# EasyEDA Pro project PicoUSBMotherboardV1.1.eprj, board PCB1
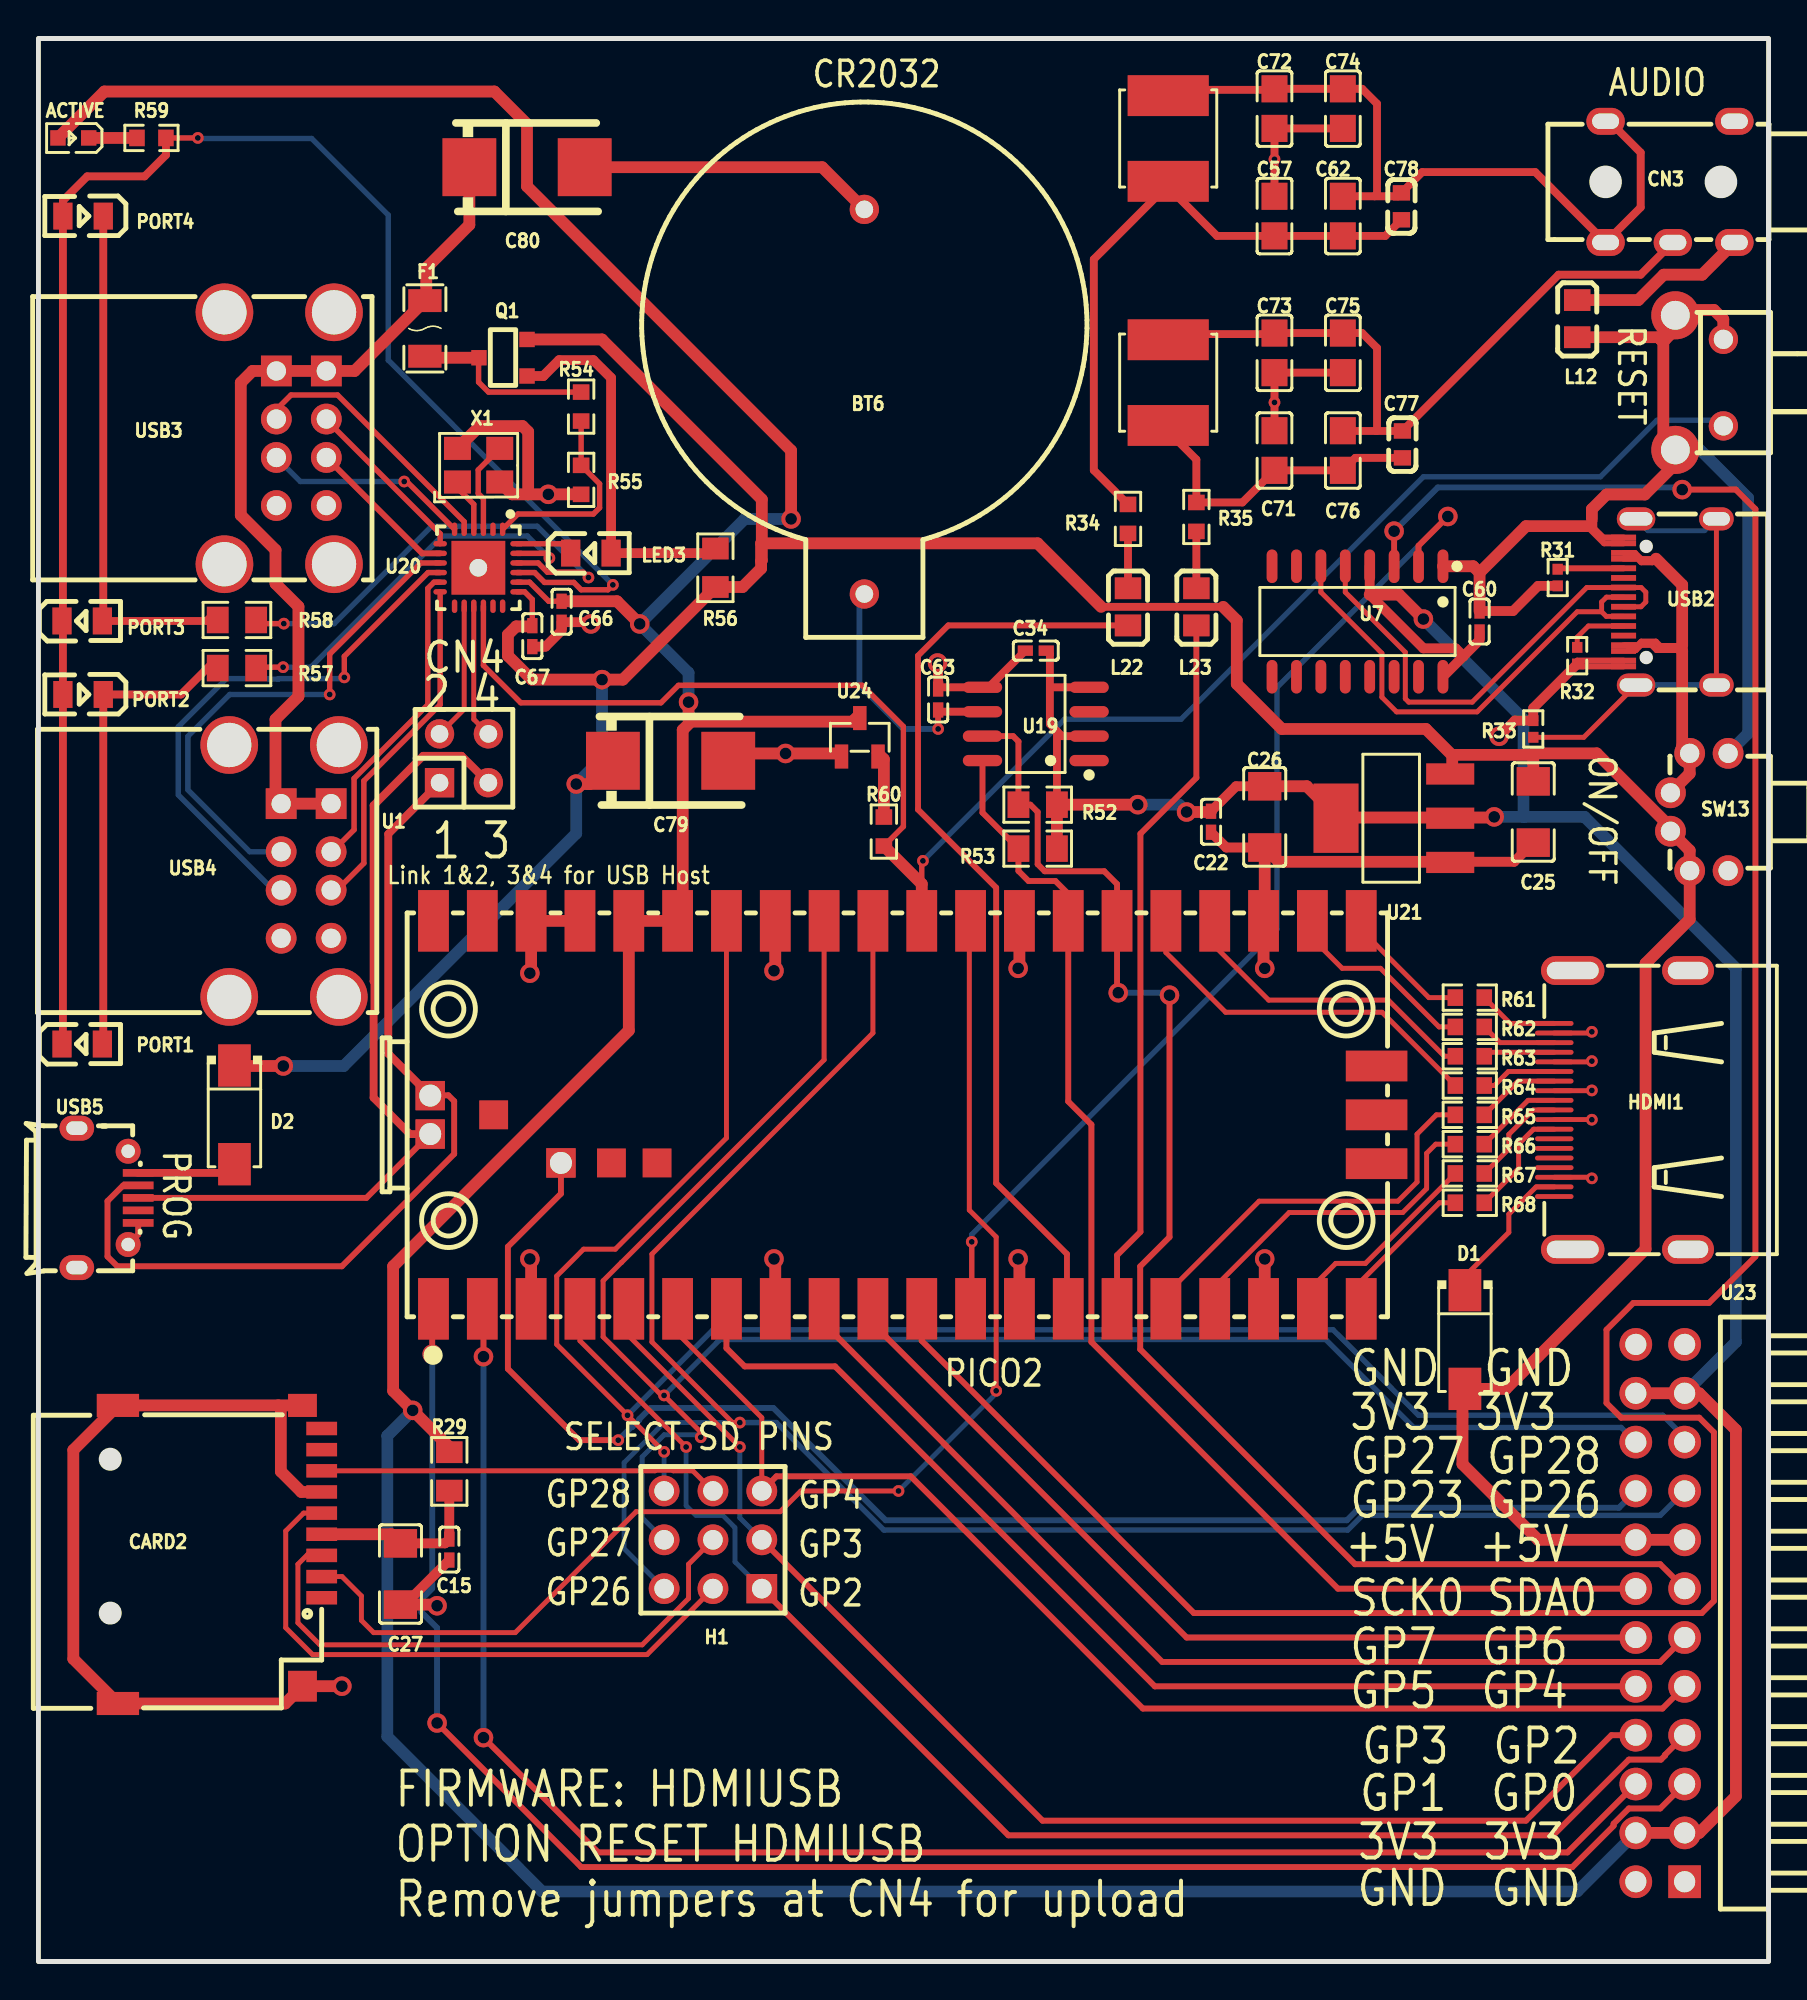
[diagram p1: board, top side]
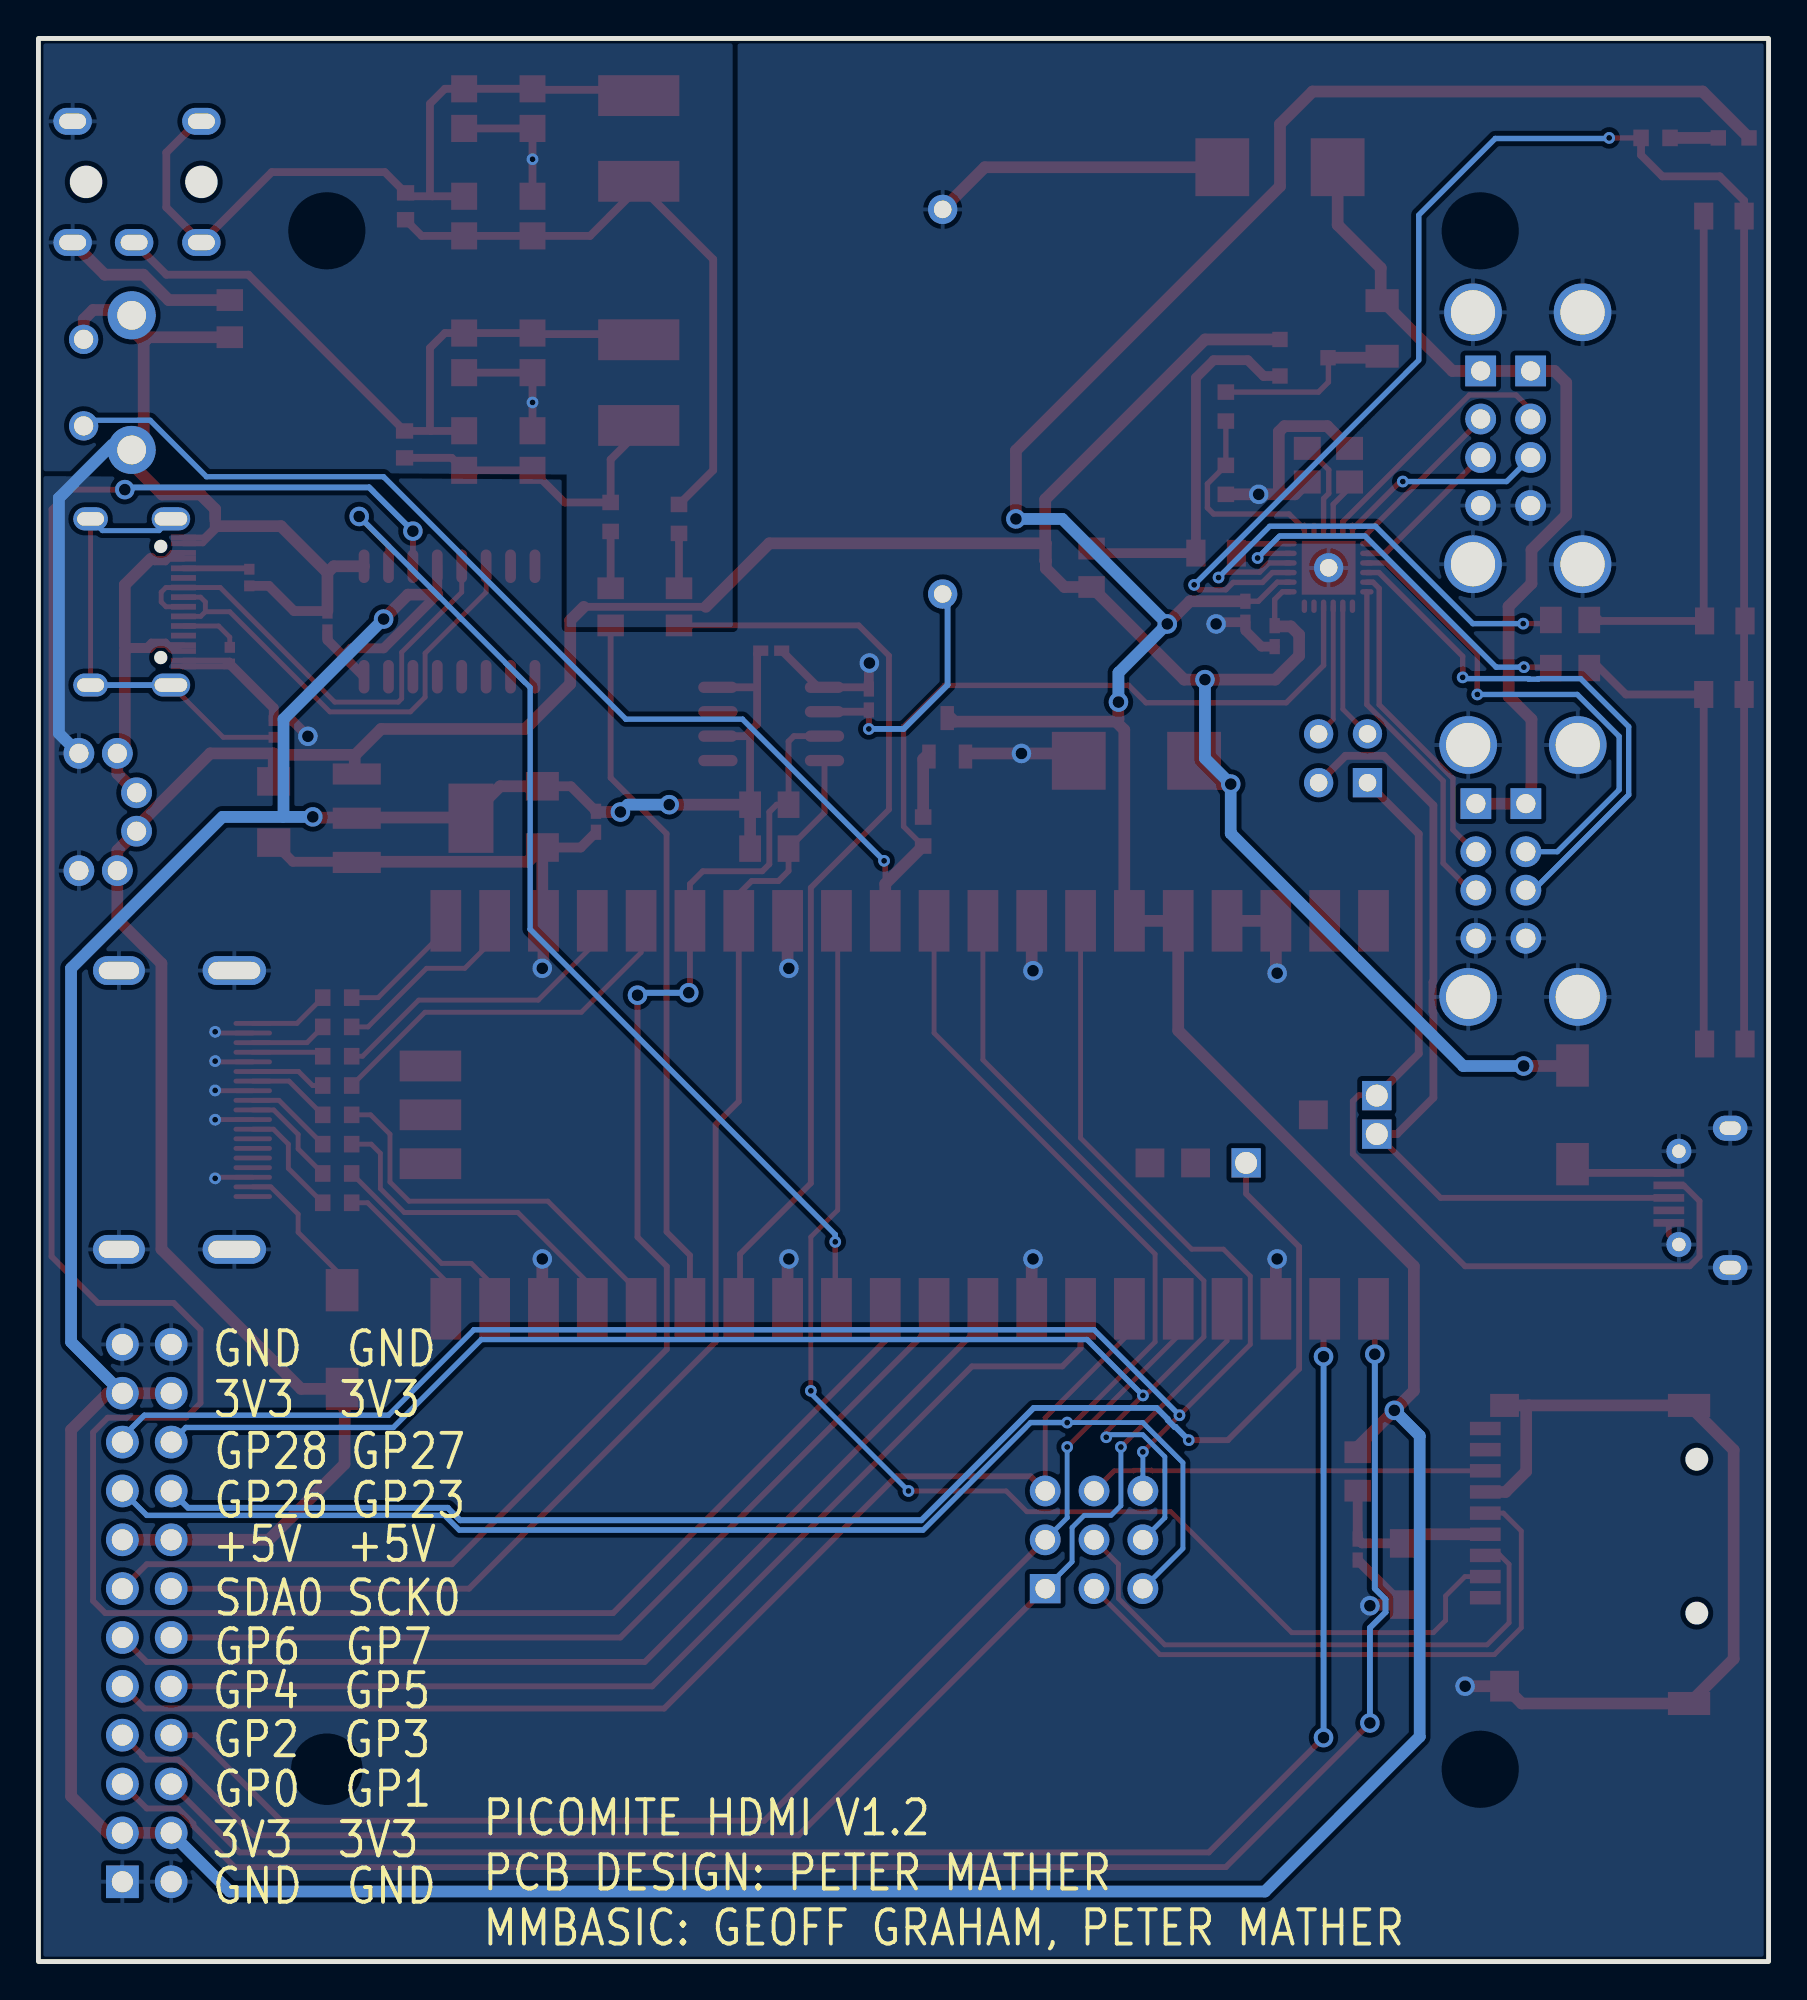
[diagram p2: board, bottom side, seen from below]

Outline 90 x 100 mm; copper layers: Top Layer, Bottom Layer. Coordinates in mm from the lower left corner of the outline.
Outline path: rectangle 0,100 90,0
Stack: Top Layer 0.035mm / Dielectric1 1.51mm FR4 er 4.5 / Bottom Layer 0.035mm

## Design rules (mm)
template: JLCPCB Capability(Two Layers Board)
spacing copperThickness1oz (default): track to track 0.102, other pairs 0.152 to 0.3
spacing copperThickness2oz: track to track 0.203, other pairs 0.152 to 0.3
track width copperThickness1oz (default): min 0.127, default 0.254, max 2.54
track width copperThickness2oz: min 0.203, default 0.254, max 2.54
differential pair differentialPair (default): width min 0.127, default 0.254, max 2.54; gap min 0.152, default 0.152
via viaSize (default): diameter min 0.5, default 0.61, max 10; hole min 0.3, default 0.305, max 6.3

## Placement (name value [footprint] x y rotation side)
ACTIVE  KT-0603R  [LED0603-RD]  1.81 94.83 180 top
BT6  BS-04-A1BJ005  [BAT-TH_BS-04-A1BJ004]  42.96 81.11 270 top
C15  100nF  [C0402_NEW]  21.37 21.42 90 top
C22  100nF  [C0402_NEW]  61 59.27 90 top
C25  10uF  [C1206]  77.76 59.78 90 top
C26  10uF  [C1206]  63.79 59.52 90 top
C27  10uF  [C1206]  18.83 20.15 90 top
C34  100nF  [C0402_NEW]  51.88 68.17 180 top
C57  33nF  [C0805]  64.3 90.76 270 top
C60  100nF  [C0402_NEW]  74.97 69.68 270 top
C62  2.2nF  [C0805]  67.85 90.76 90 top
C63  100nF  [C0402]  46.8 65.63 90 top
C66  100nF  [C0402_NEW]  27.21 70.19 90 top
C67  100nF  [C0402_NEW]  25.69 68.92 90 top
C71  33nF  [C0805]  64.3 78.57 270 top
C72  33nF  [C0805]  64.3 96.35 90 top
C73  33nF  [C0805]  64.3 83.65 90 top
C74  33nF  [C0805]  67.85 96.35 90 top
C75  33nF  [C0805]  67.85 83.65 90 top
C76  2.2nF  [C0805]  67.85 78.57 90 top
C77  470pF  [C0603]  70.95 78.89 90 top
C78  470pF  [C0603]  70.9 91.27 90 top
C79  220uF  [CASE-D_7343]  32.88 62.44 180 top
C80  220uF  [CASE-D_7343]  25.42 93.31 180 top
CARD2  TF PUSH  [TF-SMD_TF-PUSH]  9.43 21.17 270 top
CN3  PJ-313 5JCJ  [AUDIO-TH_PJ-313_5JCJ]  84.87 92.54 180 top
CN4  RF-H042TD-1190(LF)(SN)  [HDR-TH_4P-P2.54-V-M-R2-C2-S2.54-1]  22.13 62.57 0 top
D1  SS14  [SMA_L4.2-W2.6-LS5.3-RD]  74.2 32.34 270 top
D2  SS14  [SMA_L4.2-W2.6-LS5.3-RD]  10.2 44.03 270 top
F1  BSMD1206-075-30V  [F1206]  20.1 84.92 90 top
H1  PZ254-3-03-Z-2.5-G0  [HDR-TH_9P-P2.54-V-M-R3-C3-S2.54]  35.09 21.93 90 top
HDMI1  HDMI-01  [USB-SMD_HDMI-01]  82.33 44.28 90 top
L12  BLM21PG221SN1D  [L0805]  80.05 85.43 90 top
L22  10uH  [L0805]  56.68 70.44 90 top
L23  10uH  [L0805]  60.23 70.44 90 top
L26  4.7mH  [IND-SMD_L5.0-W5.0-1]  58.77 82.1 270 top
L27  4.7mH  [IND-SMD_L5.0-W5.0-1]  58.77 94.8 270 top
LED3  KT-0805G  [LED0805-R-RD]  28.74 73.24 0 top
NOREF  -  [Pad_e2654]  22.88 72.48 0 top
NOREF#2  -  [Pad_e408]  27.18 41.53 0 top
NOREF#3  -  [Pad_e2526]  20.38 45.03 0 top
NOREF#4  -  [Pad_e2527]  20.38 43.03 0 top
PORT1  KT-0805G  [LED0805-R-RD]  2.28 47.71 0 top
PORT2  KT-0805G  [LED0805-R-RD]  2.32 65.89 180 top
PORT3  KT-0805G  [LED0805-R-RD]  2.28 69.71 0 top
PORT4  KT-0805G  [LED0805-R-RD]  2.32 90.76 180 top
Q1  MDD2301  [SOT-23-3_L2.9-W1.5-P1.90-LS2.6-BL]  24.17 83.4 90 top
R29  2.2Ω  [R0805]  21.37 25.49 90 top
R31  5.1kΩ  [R0402]  79.03 71.97 90 top
R32  5.1kΩ  [R0402]  80.05 67.9 90 top
R33  1MΩ  [R0402]  77.76 64.09 270 top
R34  220Ω  [R0603]  56.68 75.02 90 top
R35  220Ω  [R0603]  60.23 75.12 90 top
R52  10kΩ  [R0805]  51.98 60.16 0 top
R53  10kΩ  [R0805]  51.98 57.87 0 top
R54  12kΩ  [R0603]  28.23 80.86 90 top
R55  15kΩ  [R0603]  28.23 77.05 90 top
R56  4.7kΩ  [R0805]  35.22 72.48 270 top
R57  220Ω  [R0805]  10.33 67.26 180 top
R58  220Ω  [R0805]  10.33 69.76 180 top
R59  470Ω  [R0603]  5.88 94.83 180 top
R60  220Ω  [R0603]  43.98 58.76 90 top
R61  220Ω  [R0603]  74.46 50.12 0 top
R62  220Ω  [R0603]  74.46 48.6 0 top
R63  220Ω  [R0603]  74.46 47.08 0 top
R64  220Ω  [R0603]  74.46 45.55 0 top
R65  220Ω  [R0603]  74.46 44.03 0 top
R66  220Ω  [R0603]  74.46 42.5 0 top
R67  220Ω  [R0603]  74.46 40.98 0 top
R68  220Ω  [R0603]  74.46 39.46 0 top
SW13  XKB5858-Z-E  [SW-TH_XKB5858-Z-E]  86.4 59.78 270 top
SW15  TC-6615-7.5-260G  [SW-TH_4P-L7.5-W7.5-P4.50]  86.4 82.1 270 top
U1  PICO  [COMM-SMD_L51.0-W21.0-P2.54_SC0916]  44.99 44.03 0 top
U7  CH340C  [SOP-16_L10.0-W3.9-P1.27-LS6.0-BL]  68.62 69.68 180 top
U19  DS3231MZ+TRL  [SOIC-8_L4.9-W3.9-P1.27-LS6.0-BL]  51.88 64.36 90 top
U20  CH334F  [QFN-24_L4.0-W4.0-P0.50-BL-EP2.8]  22.9 72.48 180 top
U21  AMS1117-3.3  [SOT-223-3_L6.5-W3.4-P2.30-LS7.0-BR]  70.47 59.45 0 top
U23  2541WR-2x12P  [HDR-TH_24P-P2.54-H-M-R2-C12-S2.54-N]  84.36 18.12 90 top
U24  MAX809R  [SOT-23-3_L2.9-W1.3-P1.90-LS2.4-BR]  42.73 63.66 270 top
USB2  KH-TYPE-C-16P  [USB-C-SMD_KH-TYPE-C-16P]  84.87 70.7 90 top
USB3  AF SS-JB17.6  [USB-A-TH_AF-SS-JB17.6]  12.53 79.21 270 top
USB4  AF SS-JB17.6  [USB-A-TH_AF-SS-JB17.6]  12.78 56.71 270 top
USB5  MicroXNJ  [MICRO-USB-SMD_MICROXNJ]  3.59 39.71 270 top
X1  12MHz  [OSC-SMD_4P-L3.2-W2.5-BL]  22.9 77.81 0 top

## Footprints (pads in the part's own frame, mm; a bottom-side part is the same pattern mirrored in y, then rotated)
AUDIO-TH_PJ-313_5JCJ
  oval 2x1.4 hole 1.4x0.8: 1(-3.35,3.15) 1(-3.35,-3.15) 2(3.35,3.15) 2(3.35,-3.15) 3(-0.15,3.15)
BAT-TH_BS-04-A1BJ004
  round 1.524 hole 0.914: 1(10,0) 2(-10,0)
C0402
  rect 0.79x0.54 smd: 1(-0.545,0) 2(0.545,0)
C0402_NEW
  rect 0.79x0.54 smd: 1(-0.545,0) 2(0.545,0)
C0603
  rect 0.8x0.9 smd: 1(-0.7,0) 2(0.7,0)
C0805
  rect 1.41x1.35 smd: 1(-1.03,0) 2(1.03,0)
C1206
  rect 1.485x1.728 smd: 1(-1.593,0) 2(1.593,0)
CASE-D_7343
  rect 2.799x3.01 smd: 1(3,0) 2(-3,0)
COMM-SMD_L51.0-W21.0-P2.54_SC0916
  rect 1.6x3.2 smd: 1(-24.445,-10.088) 2(-21.905,-10.088) 3(-19.365,-10.088) 4(-16.825,-10.088) 5(-14.285,-10.088) 6(-11.745,-10.088) 7(-9.205,-10.088) 8(-6.665,-10.088) 9(-4.125,-10.088) 10(-1.585,-10.088) 11(0.955,-10.088) 12(3.495,-10.088) 13(6.035,-10.088) 14(8.575,-10.088) 15(11.115,-10.088) 16(13.655,-10.088) 17(16.195,-10.088) 18(18.735,-10.088) 19(21.275,-10.088) 20(23.815,-10.088) 21(23.815,10.088) 22(21.275,10.088) 23(18.735,10.088) 24(16.195,10.088) 25(13.655,10.088) 26(11.115,10.088) 27(8.575,10.088) 28(6.035,10.088) 29(3.495,10.088) 30(0.955,10.088) 31(-1.585,10.088) 32(-4.125,10.088) 33(-6.665,10.088) 34(-9.205,10.088) 35(-11.745,10.088) 36(-14.285,10.088) 37(-16.825,10.088) 38(-19.365,10.088) 39(-21.905,10.088) 40(-24.445,10.088)
  rect 3.2x1.6 smd: 41(24.615,-2.54) 42(24.615,0) 43(24.615,2.54)
  rect 1.5x1.5 smd: TP1(-21.315,0) TP2(-24.615,1) TP3(-24.615,-1) TP4(-17.815,-2.5) TP5(-15.188,-2.5) TP6(-12.815,-2.5)
F1206
  rect 1.19x1.728 smd: 1(-1.445,0) 2(1.445,0)
HDR-TH_4P-P2.54-V-M-R2-C2-S2.54-1
  rect 1.524x1.524 hole 0.914: 1(-1.27,-1.27)
  round 1.524 hole 0.914: 2(-1.27,1.27) 3(1.27,-1.27) 4(1.27,1.27)
HDR-TH_9P-P2.54-V-M-R3-C3-S2.54
  rect 1.524x1.6 hole 1.02: 1-1(-2.54,-2.54)
  round 1.6 hole 1.02: 1-2(-2.54,0) 1-3(-2.54,2.54) 2-1(0,-2.54) 2-2(0,0) 2-3(0,2.54) 3-1(2.54,-2.54) 3-2(2.54,0) 3-3(2.54,2.54)
HDR-TH_24P-P2.54-H-M-R2-C12-S2.54-N
  rect 1.7x1.7 hole 1.1: 1(-13.97,-1.27)
  round 1.7 hole 1.1: 2(-13.97,1.27) 3(-11.43,-1.27) 4(-11.43,1.27) 5(-8.89,-1.27) 6(-8.89,1.27) 7(-6.35,-1.27) 8(-6.35,1.27) 9(-3.81,-1.27) 10(-3.81,1.27) 11(-1.27,-1.27) 12(-1.27,1.27) 13(1.27,-1.27) 14(1.27,1.27) 15(3.81,-1.27) 16(3.81,1.27) 17(6.35,-1.27) 18(6.35,1.27) 19(8.89,-1.27) 20(8.89,1.27) 21(11.43,-1.27) 22(11.43,1.27) 23(13.97,-1.27) 24(13.97,1.27)
IND-SMD_L5.0-W5.0-1
  rect 2.124x4.22 smd: 1(2.228,0) 2(-2.228,0)
L0805
  rect 1.133x1.377 smd: 1(-0.966,0) 2(0.966,0)
LED0603-RD
  rect 0.8x0.8 smd: 1(-0.799,0) 2(0.799,0)
LED0805-R-RD
  rect 1x1.399 smd: 1(1.05,0) 2(-1.05,0)
MICRO-USB-SMD_MICROXNJ
  rect 0.4x1.6 smd: 1(-1.3,1.597) 2(-0.65,1.597) 3(0,1.597) 4(0.65,1.597) 5(1.3,1.597)
  round 1.3 hole 0.7: 6(2.425,1.074) 9(-2.425,1.073)
  oval 1.3x1.8 hole 0.7x1.1: 7(3.625,-1.597) 8(-3.625,-1.597)
OSC-SMD_4P-L3.2-W2.5-BL
  rect 1.4x1.2 smd: 1(-1.1,-0.875) 2(1.1,-0.875) 3(1.1,0.875) 4(-1.1,0.875)
Pad_e408
  rect 1.524x1.524 hole 1.143: 1(0,0)
Pad_e2526
  rect 1.524x1.524 hole 1.143: 1(0,0)
Pad_e2527
  rect 1.524x1.524 hole 1.143: 2(0,0)
Pad_e2654
  round 1.524 hole 0.914: 1(0,0)
QFN-24_L4.0-W4.0-P0.50-BL-EP2.8
  oval 0.28x0.7 smd: 1(-1.25,-2) 2(-0.75,-2) 3(-0.25,-2) 4(0.25,-2) 5(0.75,-2) 6(1.25,-2) 13(1.25,2) 14(0.75,2) 15(0.25,2) 16(-0.25,2) 17(-0.75,2) 18(-1.25,2)
  oval 0.7x0.28 smd: 7(2,-1.25) 8(2,-0.75) 9(2,-0.25) 10(2,0.25) 11(2,0.75) 12(2,1.25) 19(-2,1.25) 20(-2,0.75) 21(-2,0.25) 22(-2,-0.25) 23(-2,-0.75) 24(-2,-1.25)
  rect 2.8x2.8 smd: 25(0.013,0)
R0402
  rect 0.566x0.54 smd: 1(-0.433,0) 2(0.433,0)
R0603
  rect 0.806x0.864 smd: 1(-0.753,0) 2(0.753,0)
R0805
  rect 1.133x1.377 smd: 1(-1,0) 2(1,0)
SMA_L4.2-W2.6-LS5.3-RD
  rect 2.2x1.7 smd: 1(-2.566,0) 2(2.566,0)
SOIC-8_L4.9-W3.9-P1.27-LS6.0-BL
  oval 0.588x2.045 smd: 1(-1.905,-2.772) 2(-0.635,-2.772) 3(0.635,-2.772) 4(1.905,-2.772) 5(1.905,2.772) 6(0.635,2.772) 7(-0.635,2.772) 8(-1.905,2.772)
SOP-16_L10.0-W3.9-P1.27-LS6.0-BL
  oval 0.56x1.745 smd: 1(-4.445,-2.873) 2(-3.175,-2.873) 3(-1.905,-2.873) 4(-0.635,-2.873) 5(0.635,-2.873) 6(1.905,-2.873) 7(3.175,-2.873) 8(4.445,-2.873) 9(4.445,2.873) 10(3.175,2.873) 11(1.905,2.873) 12(0.635,2.873) 13(-0.635,2.873) 14(-1.905,2.873) 15(-3.175,2.873) 16(-4.445,2.873)
SOT-23-3_L2.9-W1.3-P1.90-LS2.4-BR
  rect 1.25x0.7 smd: 1(1,-0.95) 2(1,0.95) 3(-1,0)
SOT-23-3_L2.9-W1.5-P1.90-LS2.6-BL
  rect 0.8x0.8 smd: 1(-0.95,-1.25) 2(0.95,-1.25) 3(0,1.25)
SOT-223-3_L6.5-W3.4-P2.30-LS7.0-BR
  rect 2.5x1.1 smd: 1(2.97,-2.3) 2(2.97,0) 3(2.97,2.3)
  rect 2.34x3.6 smd: 4(-2.97,0)
SW-TH_4P-L7.5-W7.5-P4.50
  round 1.524 hole 1: 1(-2.25,1.25) 2(2.25,1.25)
  round 2.5 hole 1.5: 3(-3.5,-1.25) 4(3.5,-1.25)
SW-TH_XKB5858-Z-E
  round 1.6 hole 1: 1(-3.05,1.5) 2(-3.05,-0.5) 3(3.05,1.5) 4(3.05,-0.5) 5(-1,-1.5) 6(1,-1.5)
TF-SMD_TF-PUSH
  rect 0.7x1.6 smd: 1(2.25,5.3) 2(1.15,5.3) 3(0.05,5.3) 4(-1.05,5.3) 5(-2.15,5.3) 6(-3.25,5.3) 7(-4.35,5.3) 8(-5.45,5.3) CD(-6.55,5.3)
  rect 1.2x1.5 smd: 10(-7.75,4.3)
  rect 1.2x2.2 smd: 11(-7.75,-5.3) 12(7.75,-5.3)
  rect 1.6x1.5 smd: 13(6.85,4.3)
USB-A-TH_AF-SS-JB17.6
  rect 1.6x1.6 hole 1: 1(-3.5,2.45) 5(-3.5,-0.15)
  round 1.6 hole 1: 2(-1,2.45) 3(1,2.45) 4(3.5,2.45) 6(-1,-0.15) 7(1,-0.15) 8(3.5,-0.15)
  round 3 hole 2.3: 9(-6.55,2.85) 10(6.55,2.85) 11(-6.55,-2.85) 12(6.55,-2.85)
USB-C-SMD_KH-TYPE-C-16P
  oval 1.2x2 hole 0.7x1.7: 1(-4.32,1.765) 2(4.32,1.765)
  oval 1.2x1.8 hole 0.7x1.4: 3(-4.32,-2.415) 4(4.32,-2.415)
  rect 0.3x1.3 smd: A1(-3.35,2.415) A4(-2.55,2.415) A5(-1.25,2.415) A6(-0.25,2.415) A7(0.25,2.415) A8(1.25,2.415) A9(2.55,2.415) A12(3.35,2.415) B1(3.05,2.415) B4(2.25,2.415) B5(1.75,2.415) B6(0.75,2.415) B7(-0.75,2.415) B8(-1.75,2.415) B9(-2.25,2.415) B12(-3.05,2.415)
USB-SMD_HDMI-01
  oval 0.25x2 smd: 1(4.501,3.479) 2(4,3.479) 3(3.5,3.479) 4(2.999,3.479) 5(2.499,3.479) 6(1.999,3.479) 7(1.501,3.479) 8(1.001,3.479) 9(0.5,3.479) 10(0,3.479) 11(-0.5,3.479) 12(-1.001,3.479) 13(-1.498,3.479) 14(-1.999,3.479) 15(-2.499,3.479) 16(-2.999,3.479) 17(-3.5,3.479) 18(-4,3.479) 19(-4.501,3.479)
  oval 1.5x2.7 hole 0.9x2.1: 20(7.25,-3.479) 21(-7.25,-3.479)
  oval 1.5x3.3 hole 0.9x2.7: 22(7.25,2.52) 23(-7.25,2.52)

## Nets
As in the schematic, except:
GND: BT6.2 C15.1 C22.1 C25.1 C26.1 C27.1 C34.2 C60.1 C63.2 C66.1 C67.1 C79.2 C80.2 CARD2.6 CARD2.10 CARD2.11 CARD2.12 CARD2.13 HDMI1.2 HDMI1.5 HDMI1.8 HDMI1.11 HDMI1.17 HDMI1.20 HDMI1.21 HDMI1.22 HDMI1.23 L12.1 NOREF.1 R31.1 R32.1 R33.1 R55.1 SW13.1 SW13.3 SW15.1 SW15.3 SW15.4 U1.3 U1.8 U1.13 U1.18 U1.23 U1.28 U1.33 U1.37 U1.38 U7.1 U19.5 U20.25 U21.1 U23.1 U23.2 U23.23 U23.24 U24.1 USB2.A1 USB2.A12 USB2.B1 USB2.B12 USB3.4 USB3.8 USB3.9 USB3.10 USB3.11 USB3.12 USB4.4 USB4.8 USB4.9 USB4.10 USB4.11 USB4.12 USB5.5 USB5.6 USB5.7 USB5.8 USB5.9 X1.2 X1.4
GP23: NOREF#2.1 U1.TP4 U23.18
$1N15404: CN4.3 NOREF#4.2 U1.TP3 USB5.3
$1N15413: CN4.1 NOREF#3.1 U1.TP2 USB5.2

Pads without a net: CARD2 1 8 CD; HDMI1 13 14 15 16 19; U1 39 40 41 42 43 TP1 TP5 TP6; U7 7 8 9 10 11 12 13 14 15; U19 1 3; U20 2 13 17 18; USB2 A8 B8; USB5 4

## Via types
v1: diameter 1.016, hole 0.61, Top Layer to Bottom Layer, 35 vias
v2: diameter 0.61, hole 0.305, Top Layer to Bottom Layer, 29 vias

## Routing (per net, layer and track width the routed paths; a pad name or vN(x,y) marks a point on that pad's centre or on a via; arc(x,y) is an arc through that point)
5VIN: length 23
  Top Layer w0.305: 84.13,72.93 83.96,72.76 83.38,72.76 83.19,72.95 USB2.B4 ; 84.13,72.93 83.37,72.93 83.05,73.25 USB2.A9 ; 84.13,72.93 84.15,72.95 ; 82.71,68.2 83.1,68.2 83.37,68.46 83.91,68.46 84.17,68.2 85.29,68.2 85.38,68.28 85.25,68.41 84.36,68.41 84.14,68.64 83.38,68.64 83.19,68.45 USB2.B9
  Top Layer w0.61: 85.38,68.28 85.51,68.16 85.51,63.21 SW13.2 85.9,61.78 SW13.5 ; 85.51,68.41 85.51,71.59 84.15,72.95
+5V: length 185.5
  Top Layer w0.28: U20.19 25.29,71.23 25.69,70.83 C67.2
  Top Layer w0.406: 55.28,70.44 61.63,70.44
  Top Layer w0.61: v1(12.74,46.57) 10.22,46.57 D2.1 ; 77.76,62.75 C25.2 ; 77.76,62.75 77.76,62.82 81.06,62.82 84.9,58.99 SW13.6 85.9,57.78 SW13.4 85.9,54.2 83.6,51.9 83.6,37.04 76.34,29.78 D1.2 74.08,29.65 74.08,25.87 78.01,21.93 U23.16 U23.15 ; 77.76,62.75 73.55,62.75 73.55,62.72 ; 61.63,70.44 62.34,69.74 62.34,66.44 64.68,64.09 72.17,64.09 73.55,62.72 ; 37.63,73.75 37.63,72.86 37.59,72.82 ; 37.63,73.75 37.63,76.03 29.31,84.35 Q1.2 ; 37.63,73.75 51.98,73.75 55.28,70.44 ; 37.63,73.75 37.59,73.75 37.59,72.82 ; v1(27.98,61.23) 28.67,61.23 C79.1 ; 25.6,69.46 25.56,69.43 24.85,69.43 24.42,69 24.42,67.9 25.66,66.66 v1(29.32,66.66) 30.4,66.66 R56.2 36.63,71.48 37.59,72.44 37.59,72.82 ; 73.55,62.72 73.55,61.79
  Bottom Layer w0.61: v1(29.32,66.66) 29.32,62.57 v1(27.98,61.23) 27.98,58.66 15.88,46.57 v1(12.74,46.57)
GND: length 221.3
  Top Layer w0.254: 78.85,43.78 80.8,43.78 v2(80.81,43.77) ; v2(80.81,46.82) 80.77,46.78 HDMI1.5 ; HDMI1.8 80.79,45.28 v2(80.81,45.3) ; HDMI1.17 80.75,40.78 v2(80.81,40.73) ; v2(80.81,48.35) 80.75,48.28 HDMI1.2
  Top Layer w0.305: 80.93,74.89 80.68,74.64 80.68,74.51 81.44,73.75 USB2.B1 ; 80.93,74.89 80.93,74.52 81.41,74.05 USB2.A12 ; 80.93,74.89 80.81,75.02 ; USB2.B12 80.05,67.65 80.35,67.35 USB2.A1 ; USB5.5 5.19,37.81 USB5.6
  Top Layer w0.406: C63.2 46.89,66.26 U19.5 49.43,66.26 C34.2
  Top Layer w0.508: C26.1 61.79,57.93 C22.1 ; v1(46.77,67.52) 46.8,67.49 C63.2 ; 79.03,71.54 78.01,71.54 76.71,70.23 C60.1 ; C15.1 19.05,18.56 ; v1(28.74,69.55) 28.65,69.64 C66.1 27.21,69.21 26.38,68.38 C67.1 ; C25.1 76.76,57.19 73.55,57.19 ; v1(75.98,63.71) 76.8,64.53 R33.1 77.76,65.19 80.05,67.47
  Top Layer w0.61: 29.17,93.3 40.77,93.3 BT6.2 ; C27.1 20.68,18.56 v1(20.74,18.5) ; 12.48,28.92 12.61,28.78 12.61,25.49 13.68,24.42 CARD2.6 ; 12.48,28.92 4.13,28.92 1.81,26.6 1.81,15.74 4.13,13.42 12.83,13.42 CARD2.13 v1(15.78,14.32) ; 12.48,28.92 CARD2.10 ; v1(63.79,51.65) 63.73,51.71 U1.23 63.79,54.18 C26.1 64.53,57.19 73.55,57.19 ; C79.2 36.26,62.82 v1(38.87,62.82) 41.74,62.82 41.76,62.84 ; v1(63.79,36.53) 63.79,34 U1.18 ; 80.68,74.64 77.38,74.64 74.97,72.22 ; 24,76.94 24.64,76.3 25.48,76.3 ; 25.48,76.3 v1(26.52,76.3) R55.1 ; 25.48,76.3 25.48,79.55 25.18,79.84 22.95,79.84 X1.4 ; 74.97,72.22 74.63,72.55 U7.1 ; 74.97,72.22 C60.1 ; U1.33 38.33,51.59 v1(38.26,51.52) ; U1.13 51.03,36.47 v1(50.96,36.53) ; 87.9,84.35 87.65,84.61 87.65,85.39 87.16,85.88 86.16,85.88 84.62,84.34 84.39,84.34 ; 80.81,75.02 80.81,75.52 81.57,76.29 83.57,76.29 85.53,78.25 84.53,79.25 84.53,84.21 84.39,84.34 ; U1.28 51.03,51.71 v1(50.96,51.65) ; U1.8 38.33,36.47 v1(38.26,36.53) ; v1(25.56,36.53) 25.63,36.47 U1.3 ; v1(25.56,51.39) 25.63,51.46 U1.38 U1.37 ; L12.1 84.27,84.46 84.39,84.34
  Bottom Layer w0.61: 86.16,78.88 88.94,76.11 88.94,63.87 SW13.1 ; v1(15.78,14.32) 15.78,14.31
VCC: length 354.3
  Top Layer w0.28: U20.20 25.55,71.73 26.54,70.73 C66.2
  Top Layer w0.406: 52.61,66.26 54.65,66.26 ; 52.61,66.26 52.61,64.35 52.98,63.98 ; 52.61,66.26 52.61,67.98 C34.1 ; 52.98,63.98 53.24,63.72 54.65,63.72 ; 52.98,63.98 52.98,60.16 R52.2
  Top Layer w0.508: 64.17,61.11 62.3,61.11 C22.2 ; C60.2 74.97,68.71 74.13,67.88 ; U7.4 69.25,71.08 72.05,68.28 73.73,68.28 74.13,67.88 ; 74.13,67.88 U7.16
  Top Layer w0.61: v1(39.15,75.02) 39.15,78.57 25.42,92.31 25.42,95.55 23.72,97.24 3.43,97.24 ACTIVE.2 ; 33.95,64.47 42.34,64.47 42.71,64.84 ; 33.95,64.47 33.82,64.6 v1(33.82,65.49) ; 33.95,64.47 33.51,64.04 33.51,54.38 U1.35 U1.36 30.71,48.41 18.45,36.15 18.45,29.68 v1(19.47,28.66) 21.37,26.76 21.37,26.36 ; v1(75.73,59.52) 75.69,59.49 67.61,59.49 65.98,61.11 64.17,61.11 ; C66.2 30.1,70.73 v1(31.28,69.55) ; v1(59.73,59.78) 60.96,59.78 C22.2 ; R53.2 R52.2 v1(57.19,60.16) ; U23.22 U23.21 86.4,29.55 88.3,27.65 88.3,8.59 86.4,6.69 U23.3 U23.4 ; v1(72.05,69.81) 70.78,71.08 69.25,71.08
  Bottom Layer w0.61: U23.4 80.05,3.64 26.2,3.64 18.15,11.69 18.15,27.34 v1(19.47,28.66) ; U23.21 88.3,32.22 88.3,51.65 80.43,59.52 77.28,59.52 ; v1(39.15,75.02) 36.74,75.02 v1(31.28,69.55) 33.82,67.02 v1(33.82,65.49) ; 77.28,59.52 v1(75.73,59.52) ; 77.28,59.52 77.25,59.55 77.25,64.6 v1(72.05,69.81) ; v1(59.73,59.78) 59.35,60.16 v1(57.19,60.16)
A-GND: length 23.1
  Top Layer w0.406: C57.1 v2(64.3,93.72) C72.1 C74.1 ; C71.1 v2(64.3,81.07) C73.1 C75.1
  Top Layer w0.61: L12.2 83.23,86.4 84.54,87.72 86.55,87.72 CN3.1
AUDIO_L: length 48.8
  Top Layer w0.305: L22.1 47.33,69.48 45.76,67.9 45.76,59.9 49.82,55.84 49.82,40.47 53.5,36.79 53.5,34.01 U1.14
AUDIO_R: length 37.2
  Top Layer w0.305: L23.1 60.23,61.55 57.33,58.64 57.33,37.94 56.11,36.73 U1.15
CK+: length 11
  Top Layer w0.254: U1.19 66.27,35.09 67.48,36.3 69.03,36.3 R67.1
CK-: length 8
  Top Layer w0.254: R68.1 72.88,39.46 68.81,35.39 U1.20
CONSOLE-RX: length 54.7
  Top Layer w0.28: U1.12 48.55,34 v2(48.55,37.42)
  Top Layer w0.305: v1(73.32,75.14) 71.79,73.62 U7.2
  Bottom Layer w0.28: v1(73.32,75.14) 64.43,66.25 64.43,53.68 48.55,37.8 v2(48.55,37.42)
CONSOLE-TX: length 138
  Top Layer w0.305: v1(70.52,74.38) U7.3 ; v1(85.51,76.54) 88.3,76.54 89.32,75.52 89.32,36.66 86.9,34.25 82.97,34.25 81.57,32.85 81.57,29.04 82.33,28.28 86.4,28.28 87.16,27.52 87.16,18.75 86.52,18.12 60.11,18.12 45.95,32.28 U1.11
  Bottom Layer w0.305: v1(70.52,74.38) 72.79,76.65 85.39,76.65 v1(85.51,76.54)
D0+: length 21.1
  Top Layer w0.254: R65.1 72.72,44.03 71.71,43.02 71.71,40.53 70.72,39.54 63.5,39.54 58.65,34.69 U1.16
D0-: length 17.8
  Top Layer w0.254: U1.17 61.25,34 61.25,35.14 65.06,38.95 70.97,38.95 72.21,40.19 72.21,42.03 72.69,42.5 R66.1
D1+: length 16.2
  Top Layer w0.254: U1.24 61.19,52.8 64,49.99 70.22,49.99 73.14,47.08 R63.1
D1-: length 19.6
  Top Layer w0.254: R64.1 69.89,49.36 61.76,49.36 58.65,52.47 U1.25
D2+: length 6.8
  Top Layer w0.254: U1.21 68.81,53.65 72.33,50.12 R61.1
D2-: length 10.3
  Top Layer w0.254: R62.1 72.86,48.6 69.81,51.65 67.82,51.65 66.27,53.2 U1.22
DM1: length 16.6
  Top Layer w0.28: USB4.2 15.28,57.71 16.42,58.85 16.42,61.52 20.25,65.36 20.25,71.41 20.58,71.73 U20.11
DM2: length 27
  Top Layer w0.28: U20.9 19.89,72.73 15.15,67.98 v2(15.15,65.89)
  Bottom Layer w0.28: USB4.6 10.99,57.71 7.78,60.93 7.78,63.71 9.95,65.89 v2(15.15,65.89)
DM3: length 8.9
  Top Layer w0.28: U20.7 20.9,74.25 14.98,80.17 USB3.2
DM4: length 13.7
  Top Layer w0.28: USB3.6 12.38,80.7 13.14,81.46 15.56,81.46 22.15,74.87 U20.5
DP1: length 18
  Top Layer w0.28: USB4.3 15.53,55.71 16.93,57.11 16.93,61.39 20.9,65.36 U20.12
DP2: length 28.5
  Top Layer w0.28: U20.10 20.27,72.23 15.91,67.87 v2(15.91,66.78)
  Bottom Layer w0.28: USB4.7 12.23,55.71 7.28,60.67 7.28,64.21 9.78,66.71 11.96,66.71 11.98,66.69 12.48,66.69 12.5,66.71 15.84,66.71 v2(15.91,66.78)
DP3: length 8
  Top Layer w0.305: U20.8 19.96,73.23 USB3.3
DP4: length 10.8
  Top Layer w0.28: U20.6 19.16,76.96 v2(19.03,76.96)
  Bottom Layer w0.28: USB3.7 13.63,76.96 v2(19.03,76.96)
GP0: length 92
  Top Layer w0.305: v1(20.48,31.58) 20.48,33.88 U1.1 ; v1(20.74,12.41) 28.23,4.91 79.79,4.91 81.94,7.06 81.94,7.17 82.73,7.96 84.36,7.96 U23.5
  Bottom Layer w0.305: v1(20.48,31.58) 20.48,19.4 19.92,18.84 19.92,18.16 20.74,17.35 v1(20.74,12.41)
GP1: length 86.2
  Top Layer w0.305: U1.2 23.15,33.88 v1(23.15,31.45) ; v1(23.15,11.64) 29.12,5.67 79.54,5.67 U23.6
  Bottom Layer w0.305: v1(23.15,11.64) v1(23.15,31.45)
GP2: length 74.8
  Top Layer w0.254: U1.4 28.17,32.28 v2(33.69,26.76)
  Top Layer w0.305: 37.63,19.39 50.46,6.56 78.79,6.56 82.73,10.5 84.4,10.5 84.62,10.72 84.62,10.75 U23.7
  Bottom Layer w0.254: 37.63,19.39 36.23,20.79 36.23,22.56 35.6,23.2 34.2,23.2 33.69,23.71 v2(33.69,26.76)
GP3: length 68.2
  Top Layer w0.254: U1.5 30.71,32.53 v2(36.49,26.76)
  Top Layer w0.305: U23.8 81.82,11.77 77.38,7.32 52.23,7.32 37.63,21.93
  Bottom Layer w0.254: 37.63,21.93 36.49,23.07 v2(36.49,26.76)
GP4: length 65.1
  Top Layer w0.254: U1.6 33.25,32.66 37.63,28.28 37.63,24.47
  Top Layer w0.305: 37.63,24.47 38.39,25.23 45.38,25.23 57.45,13.16 84.48,13.16 U23.9
GP5: length 56.6
  Top Layer w0.305: U23.10 58.08,14.31 41.44,30.95 36.74,30.95 35.79,31.9 U1.7
GP6: length 53.3
  Top Layer w0.305: U23.11 84.36,15.58 58.46,15.58 40.87,33.17 U1.9
GP7: length 47.3
  Top Layer w0.305: U23.12 59.73,16.85 43.34,33.23 43.34,33.88 U1.10
GP22: length 67.4
  Top Layer w0.254: v2(44.74,24.47) 39.66,24.47 38.58,23.39 31.09,23.39 24.8,17.1 17.44,17.1 16.8,17.74 16.8,19.01 15.79,20.02 CARD2.2 ; U1.29 48.42,54.05 48.42,39.08 49.82,37.68 v2(49.82,29.68)
  Bottom Layer w0.254: v2(44.74,24.47) 49.82,29.55 v2(49.82,29.68)
GP23: length 75.8
  Top Layer w0.305: v2(30.16,27.11) 28.13,27.11 24.42,30.82 24.42,37.17 27.18,39.93 NOREF#2.1
  Bottom Layer w0.305: v2(30.16,27.11) 30.85,27.8 30.9,27.8 31.25,28.16 31.25,28.2 31.84,28.79 38.23,28.79 44.07,22.95 68.06,22.95 68.71,23.59 82.22,23.59 U23.18
GP26: length 99.6
  Top Layer w0.254: U1.31 43.41,48.28 31.91,36.79 31.91,32.22 36.1,28.03 v2(36.49,28.03)
  Bottom Layer w0.254: H1.1-3 30.46,21.47 30.46,25.94 32.55,28.03 v2(36.49,28.03)
  Bottom Layer w0.28: U23.17 84.36,23.2 68.87,23.2 68.11,22.44 43.98,22.44 38.39,28.03 v2(36.49,28.03)
GP27: length 96.1
  Top Layer w0.254: v2(34.45,27.26) 34.45,27.53 v2(32.54,29.44) 32.42,29.44 29.37,32.48 29.37,35.4 30.33,36.36 30.34,36.36 40.87,46.89 U1.32
  Bottom Layer w0.254: v2(34.45,27.26) 34.33,27.39 32.55,27.39 31.41,26.25 31.41,23.07 H1.2-3
  Bottom Layer w0.28: U23.20 82.33,27.77 71.54,27.77 66.97,32.34 35.45,32.34 v2(32.54,29.44)
GP28: length 96
  Top Layer w0.254: v2(32.55,26.5) v2(30.64,28.41) 26.96,32.09 26.96,35.65 28.36,37.04 30.01,37.04 35.79,42.82 U1.34
  Bottom Layer w0.254: v2(32.55,26.5) H1.3-3
  Bottom Layer w0.28: U23.19 85.63,27.26 84.49,28.41 71.79,28.41 67.35,32.85 35.09,32.85 v2(30.64,28.41)
I2C0SCK: length 67
  Top Layer w0.305: U23.14 67.6,19.39 54.77,32.22 54.77,43.52 53.57,44.72 U1.27 53.57,55.52 52.9,56.19 51.5,56.19 50.98,56.71 R53.1 49.11,59.74 U19.8
I2C0SDA: length 74.6
  Top Layer w0.305: U19.7 50.7,63.72 50.98,63.44 R52.1 51.6,60.16 51.98,59.78 51.98,57.06 52.35,56.69 55.44,56.69 56.11,56.03 U1.26 56.11,50.44 v1(56.17,50.38) ; U23.13 84.36,20.66 68.49,20.66 57.31,31.84 57.31,36.15 58.84,37.67 v1(58.84,50.25)
  Bottom Layer w0.305: v1(58.84,50.25) 58.71,50.38 v1(56.17,50.38)
LED1: length 26.8
  Top Layer w0.406: 8.93,69.89 8.75,69.71 PORT3.1 3.37,69.76 PORT4.2
LED2: length 23.7
  Top Layer w0.406: 8.94,67.41 7.42,65.89 PORT2.2 3.37,48.35
LED4: length 93.2
  Top Layer w0.28: U20.21 25.81,72.23 26.33,71.71 27.85,71.71 28.23,71.33 29.63,71.33 v2(29.88,71.59) ; v2(8.29,94.83) R59.1
  Top Layer w0.406: R59.1 6.63,93.94 5.52,92.83 2.54,92.83 1.27,91.56 PORT4.1 PORT2.1 1.27,48.35
  Bottom Layer w0.28: v2(8.29,94.83) 8.32,94.8 14.21,94.8 18.2,90.82 18.2,83.27 v2(29.88,71.59)
RESET: length 90.9
  Top Layer w0.28: R60.1 44.99,59.02 44.99,64.22 42.85,66.36 33.29,66.36 32.39,65.46 25.09,65.46 23.15,67.4 U20.16 ; 45.95,56.04 45.95,57.17 v2(46.01,57.24)
  Top Layer w0.61: R60.1 45.95,56.04 U1.30
  Bottom Layer w0.28: v2(46.01,57.24) 53.38,64.6 59.44,64.6 72.05,77.21 81.26,77.21 84.19,80.15 87.36,80.15 87.47,80.03 87.65,80.03 87.65,79.85
SPIRX: length 20.8
  Top Layer w0.254: H1.3-2 34.04,25.52 33.03,25.52 33,25.55 32.1,25.55 32.07,25.52 CARD2.7
SPISCK: length 31.5
  Top Layer w0.254: CARD2.5 13.79,23.32 12.86,22.39 12.86,17.36 14.26,15.96 31.66,15.96 H1.1-2
SPITX: length 29.9
  Top Layer w0.254: CARD2.3 14.68,21.17 14.01,21.17 13.5,20.66 13.5,17.61 14.64,16.47 31.41,16.47 33.82,18.88 33.82,20.66 H1.2-2
USB-DM: length 25
  Top Layer w0.254: USB2.A7 81.57,70.95 81.32,70.7 81.32,70.19 ; U7.6 66.71,71.21 69.89,68.03 69.89,65.74 70.65,64.98 74.84,64.98 80.05,70.19 81.32,70.19 ; 81.32,70.19 81.56,69.95 USB2.B7
USB-DP: length 25.1
  Top Layer w0.254: USB2.A6 83.36,70.45 83.61,70.7 83.61,71.21 83.37,71.45 USB2.B6 80.54,71.45 74.59,65.49 71.28,65.49 71.1,65.67 71.1,68.08 67.98,71.21 U7.5
VUSBOUT: length 45.5
  Top Layer w0.61: 14.93,60.21 12.33,60.21 12.33,64.59 13.53,65.79 13.53,70.46 12.33,71.65 12.33,73.4 10.53,75.21 10.53,82.1 11.13,82.71 USB3.5 USB3.1 16.45,82.71 F1.2 20.17,86.44 20.17,88.06 22.42,90.31 C80.1
$1N1726: length 9.3
  Top Layer w0.508: C27.2 21.15,21.74 C15.2 21.37,24.36
  Top Layer w0.61: C27.2 18.36,22.22 CARD2.4
$1N2125: length 3.4
  Top Layer w0.305: R31.2 79.08,72.45 USB2.B5
$1N2134: length 3
  Top Layer w0.254: 80.05,68.51 80.05,68.87 80.63,69.45 USB2.A5
$1N2136: length 24
  Top Layer w0.254: USB2.1 80.39,63.66 R33.2 ; USB2.4 USB2.3
  Bottom Layer w0.254: USB2.4 86.67,74.4 83.72,74.4 USB2.2
  Bottom Layer w0.305: USB2.1 USB2.3
$1N3404: length 13.2
  Top Layer w0.305: C63.1 v2(46.8,64.09)
  Top Layer w0.406: C63.1 46.89,64.99 U19.6
  Bottom Layer w0.305: v2(46.8,64.09) 44.99,64.09 42.71,66.38 42.71,70.86 BT6.1
$1N4723: length 4.8
  Top Layer w0.28: 24,78.69 22.88,77.57 22.88,76.34 23.15,76.07 U20.3
$1N4727: length 2.8
  Top Layer w0.28: X1.1 21.8,76.62 22.65,75.77 U20.4
$1N5731: length 3
  Top Layer w0.28: U20.24 27.2,73.73 LED3.2
$1N5735: length 19.7
  Top Layer w0.508: Q1.1 26.26,82.45 27.09,83.27 28.87,83.27 29.79,82.35 LED3.1 34.98,73.24 R56.1
$1N5984: length 10.4
  Top Layer w0.28: R54.1 28.23,77.8 29.19,76.84 29.19,75.59 28.87,75.27 24.94,75.27 U20.1
$1N6229: length 20.8
  Top Layer w0.28: v2(26.58,72.98) 26.34,73.23 U20.23 ; 10.94,67.41 11.05,67.31 v2(12.73,67.31)
  Bottom Layer w0.28: v2(26.58,72.98) 25.44,74.13 20.99,74.13 14.17,67.31 v2(12.73,67.31)
$1N6268: length 25
  Top Layer w0.28: v2(28.61,71.97) 28.33,72.25 26.47,72.25 25.99,72.73 U20.22 ; v2(12.76,69.57) 11.26,69.57 10.93,69.89
  Bottom Layer w0.28: v2(12.76,69.57) 15.39,69.57 20.45,74.63 25.94,74.63 v2(28.61,71.97)
$1N6542: length 9.7
  Top Layer w0.28: R54.2 23.41,81.61 22.9,82.13 22.9,83.38 Q1.3
  Top Layer w0.508: 20.18,83.4 F1.1
  Top Layer w0.61: Q1.3 20.18,83.4
$1N6846: length 2.5
  Top Layer w0.61: ACTIVE.1 R59.2
$1N9100: length 3.5
  Top Layer w0.61: 43.66,62.84 43.98,62.52 R60.2
$1N9960: length 2.9
  Top Layer w0.406: R34.1 L22.2
$1N9961: length 3
  Top Layer w0.406: R35.1 L23.2
$1N9963: length 32.5
  Top Layer w0.406: C78.1 70.06,89.73 C62.1 C57.2 61.3,89.73 58.71,92.33 54.9,88.52 54.9,77.55 R34.2
$1N9965: length 16.1
  Top Layer w0.406: C77.1 68.5,78.19 C76.1 C71.2 62.63,75.87 R35.2 60.23,78.1 58.71,79.63
$1N12629: length 7.9
  Top Layer w0.254: HDMI1.18 77.91,40.28 76.49,38.86 76.49,37.92 74.2,35.63 D1.1
$1N12872: length 39.8
  Top Layer w0.406: 58.71,97.33 64.24,97.33 C72.2 C74.2 68.86,97.38 69.63,96.61 69.63,91.92 69.51,91.79 ; 69.51,91.79 70.72,91.79 C78.2 71.98,93.05 77.86,93.05 CN3.2 83.35,91.22 83.35,94.07 81.72,95.69 CN3.2 ; 69.51,91.79 C62.2
$1N15318: length 36.8
  Top Layer w0.406: 69.59,79.59 69.63,79.64 69.63,83.91 68.86,84.68 C75.2 C73.2 64.24,84.63 58.71,84.63 ; 69.59,79.59 C77.2 79.08,87.72 83.35,87.72 CN3.3 ; 69.59,79.59 67.87,79.59 C76.2
$1N15400: length 6.9
  Top Layer w0.254: U20.15 22.65,64.6 23.4,63.84
$1N15404: length 43.1
  Top Layer w0.305: U1.TP3 17.06,39.71 USB5.3
  Top Layer w0.406: 23.4,61.3 22.01,62.7 20.01,62.7 17.44,60.12 17.44,50.97 17.48,50.93 17.48,49.39 17.44,49.35 17.44,44.92 19.32,43.03 U1.TP3
$1N15409: length 7.2
  Top Layer w0.254: U20.14 22.15,65.12 CN4.2
$1N15413: length 47.9
  Top Layer w0.305: USB5.2 4.41,40.36 3.59,39.54 3.59,36.66 4.1,36.15 15.78,36.15 21.63,42 21.63,44.74 21.32,45.04 20.4,45.04 U1.TP2
  Top Layer w0.406: CN4.1 18.2,58.63 18.2,47.21 U1.TP2
$1N19302: length 5.2
  Top Layer w0.406: D2.2 9.74,41.01 USB5.1
$1N22005: length 4.2
  Top Layer w0.254: HDMI1.1 76.55,48.78 R61.2
$1N22047: length 4
  Top Layer w0.254: R62.2 76.03,47.78 HDMI1.3
$1N22089: length 3.7
  Top Layer w0.254: R63.2 75.42,47.28 78.85,47.28
$1N22131: length 3.9
  Top Layer w0.254: R64.2 75.74,45.55 76.47,46.28 HDMI1.6
$1N22173: length 4.4
  Top Layer w0.254: 78.85,45.78 76.97,45.78 R65.2
$1N22252: length 5.4
  Top Layer w0.254: R67.2 76.49,42.26 76.49,43.01 77.76,44.28 HDMI1.10
$1N22294: length 6
  Top Layer w0.254: HDMI1.12 77.78,43.28 77,42.5 77,41.24 R68.2
$1N22336: length 4.6
  Top Layer w0.254: HDMI1.9 77.49,44.78 R66.2

## Copper pours and planes (outline as drawn; the poured copper is in the pictures)
GND on Bottom Layer: 0.03,100.03 89.87,100.03 89.87,0 0.03,0
VCC on Top Layer: 55.92,68.05 89.93,68.05 89.93,56.21 55.92,56.21
A-GND on Bottom Layer: 53.88,69.39 62.52,69.39 62.52,77.32 90,77.5 90,100 53.88,99.91

## Text on the board
Bottom Silkscreen Layer: PICOMITE HDMI V1.2 / PCB DESIGN: PETER MATHER / MMBASIC: GEOFF GRAHAM, PETER MATHER | GP28 GP27 | GP26 GP23 | SDA0 SCK0 | GP6  GP7 | 3V3  3V3 | GP0  GP1 | GND  GND | +5V  +5V | GP4  GP5 | GP2  GP3
Top Silkscreen Layer: Link 1&2, 3&4 for USB Host | GP28 | GP27 | GP26 | SELECT SD PINS | GP4 | GP3 | GP2 | PROG | ON/OFF | RESET | CR2032 | PICO2 | AUDIO | 2 4 | 1 3 | +5V  +5V | GND  GND | 3V3  3V3 | GP27 GP28 | GP23 GP26 | SCK0 SDA0 | GP7  GP6 | GP5  GP4 | GP1  GP0 | GP3  GP2 | FIRMWARE: HDMIUSB / OPTION RESET HDMIUSB / Remove jumpers at CN4 for upload
